# EAGLE design FPC_Breakout (EAGLE 6.2)
AUTHOR: Ryan Julian (ryanjulian@berkeley.edu); DESIGN_NAME: FPC Breakout; REVISION: A; YEAR: 2012
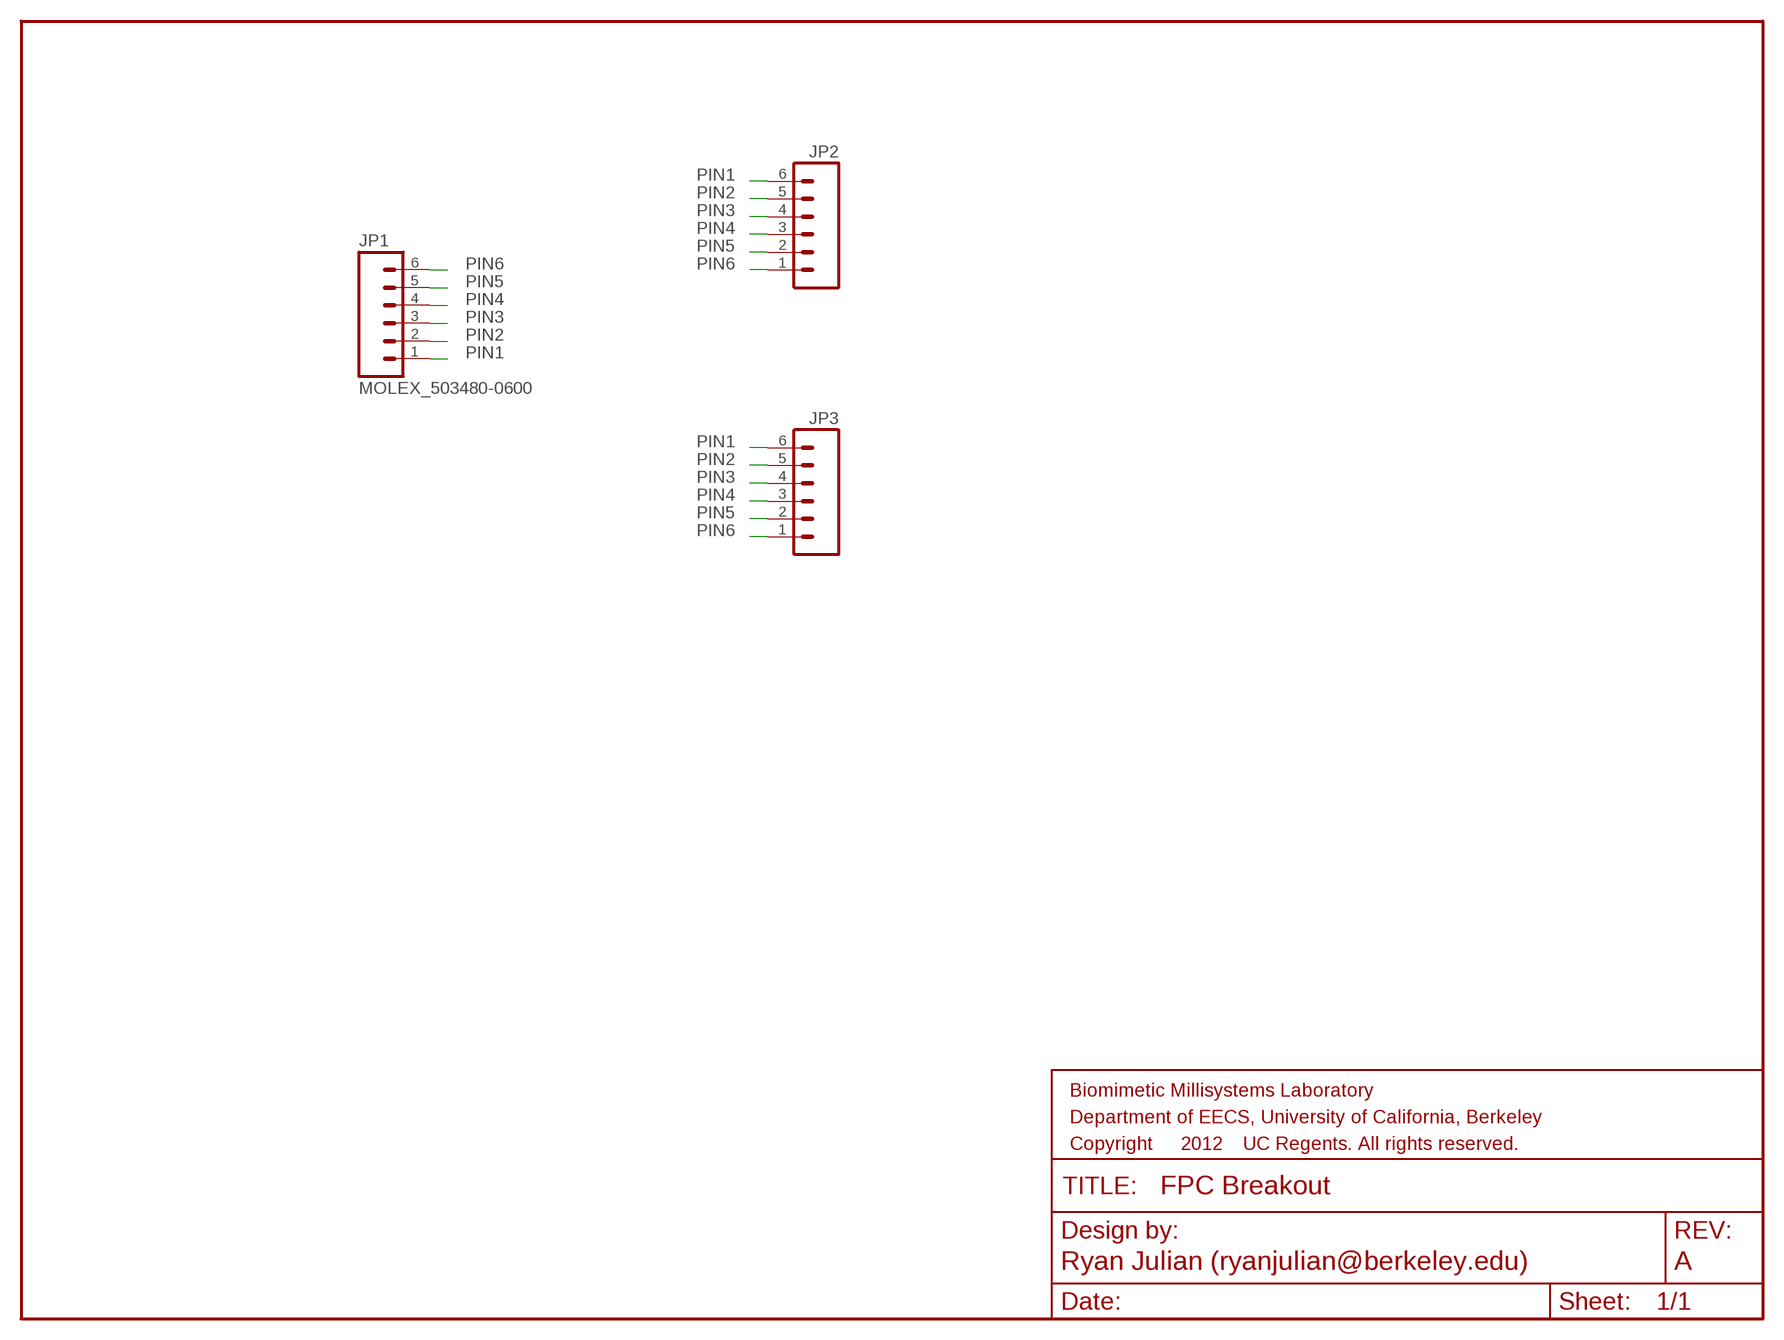
[diagram p0: schematic, sheet 1]
FRAME1 (FRAME-LETTER): SHEET_NAME: FPC Breakout

## Parts
JP1  MOLEX_503480-0600  [MOLEX_503480-0600]
JP2  M06SIP_LOCK  [1X06-SIP_LOCK]
JP3  M061X06-SMD_EDGE_FEMALE  [1X06-SMD_EDGE]

## Nets
PIN1: JP1.1 JP2.6 JP3.6
PIN2: JP1.2 JP2.5 JP3.5
PIN3: JP1.3 JP2.4 JP3.4
PIN4: JP1.4 JP2.3 JP3.3
PIN5: JP1.5 JP2.2 JP3.2
PIN6: JP1.6 JP2.1 JP3.1

## Library data of the parts
JP1 = biomimetic:MOLEX_503480-0600
JP2 JP3 = SparkFun-Connectors:M06: Header 6 Standard 6-pin 0.1" header. Use with straight break away headers (SKU : PRT-00116), right angle break away headers (PRT-00553), swiss pins (PRT-00743), machine pins (PRT-00117), and female headers (PRT-00115). Molex polarized connector foot print use with SKU : PRT-08094 with associated crimp pins and housings. NOTES ON THE VARIANTS LOCK and LOCK_LONGPADS... This footprint was designed to help hold the alignment of a through-hole component (i.e. 6-pin header) while soldering it into place. You may notice that each hole has been shifted either up or down by 0.005 of an inch from it's more standard position (which is a perfectly straight line). This slight alteration caused the pins (the squares in the middle) to touch the edges of the holes. Because they are alternating, it causes a "brace" to hold the component in place. 0.005 has proven to be the perfect amount of "off-center" position when using our standard breakaway headers. Although looks a little odd when you look at the bare footprint, once you have a header in there, the alteration is very hard to notice. Also, if you push a header all the way into place, it is covered up entirely on the bottom side. This idea of altering the position of holes to aid alignment will be further integrated into the Sparkfun Library for other footprints. It can help hold any component with 3 or more connection pins.

## Net classes
1 sup: width 0.254 mm

## Board
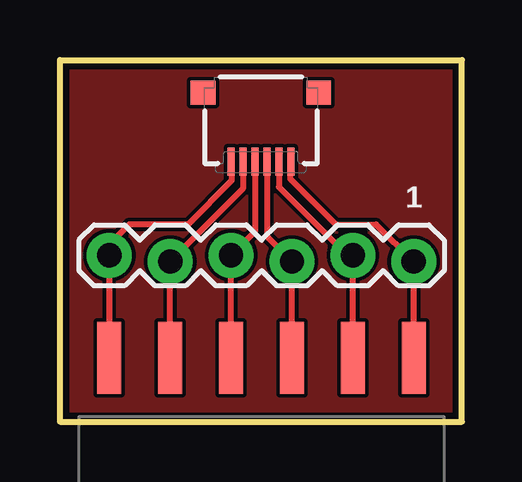
[diagram p1: board, top side]
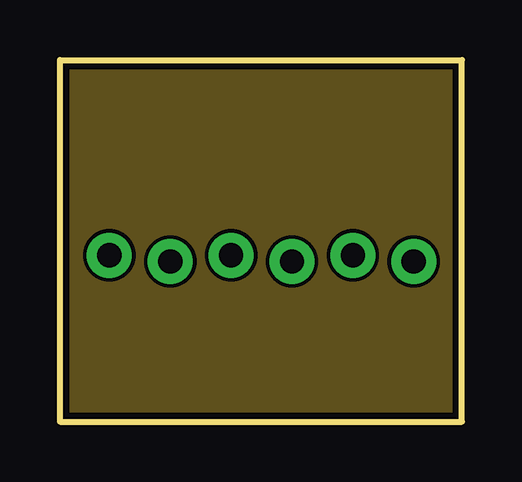
[diagram p2: board, inner layer Ground]
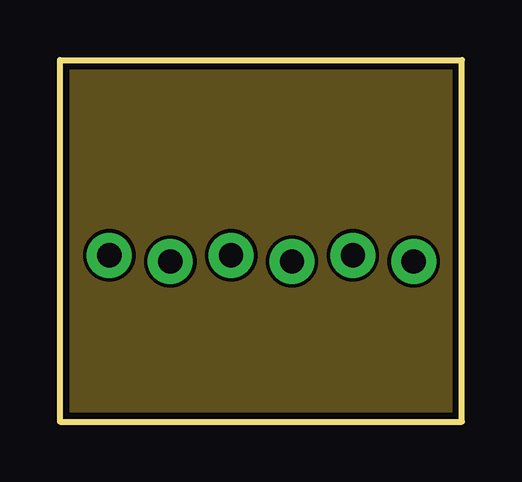
[diagram p3: board, inner layer Power]
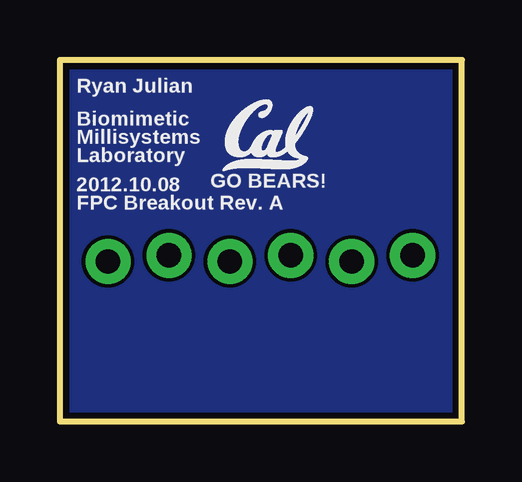
[diagram p4: board, bottom side, seen from below]

Size 16.76 x 15.1 mm. Coordinates in mm from the lower left corner, seen from the top.
Outline: 0,0.01 0,0
Outline: 0,0.01 0,15.1 16.76,15.1 16.76,0.01 0,0.01
Copper layers (1*2+3*16): Top 2mil / dielectric 9mil / Ground 2mil / dielectric 40mil / Power 2mil / dielectric 9mil / Bottom 2mil
Design rules: minimum track width 6mil, minimum drill 15mil, track to track 6mil, track to pad 6mil, pad to pad 6mil, via to via 6mil, smd to smd 6mil, copper to edge 10mil, drill to drill 7mil, minimum pad ring 7mil, minimum via ring 7mil, stop-mask expansion 3mil, vias tented up to drill 0mil, thermal gap 10mil
tKeepout: 4 lines
bKeepout: 4 lines

### Footprints (pad centres in the part's own frame; a part is rotated, then mirrored left to right if it is on the bottom)
MOLEX_503480-0600 = smd 0.3 x 1.15: 1 -1.25,1.725; 2 -0.75,1.725; 3 -0.25,1.725; 4 0.25,1.725; 5 0.75,1.725; 6 1.25,1.725 | smd 1.035 x 1: L -2.408,-1.15; R 2.408,-1.15
1X06-SIP_LOCK = drill 1.016 pad 1.88: 1 0,0; 2 2.54,-0.254; 3 5.08,0; 4 7.62,-0.254; 5 10.16,0; 6 12.7,-0.254
1X06-SMD_EDGE = smd 1 x 3: 1 0,-0.08; 2 2.54,-0.08; 3 5.08,-0.08; 4 7.62,-0.08; 5 10.16,-0.08; 6 12.7,-0.08

### Placement (x,y rotation side)
JP1  8.38,12.58 180 top
JP2  2.06,6.94 0 top
JP3  2.06,2.75 0 top
U$12  [CAL_LOGO]  9.98,10.45 0 bottom

### Tracks (layer width: path | path; a pad name or v marks a point on that pad's centre or on a via)
GND
  pour Top: 0,15.1 16.76,15.1 16.76,0.01 0,0.01
  pour Ground: 0,15.1 16.76,15.1 16.76,0.01 0,0.01
  pour Bottom: 0,15.1 16.76,15.1 16.76,0.01 0,0.01
PIN1
  Top 0.254: JP1.1 9.6,10.83 9.6,10.14 11.51,8.24 13.18,8.24 14.73,6.69 JP2.6 JP3.6
PIN2
  Top 0.254: JP1.2 9.13,9.8 11.99,6.94 JP2.5 JP3.5
PIN3
  Top 0.254: JP1.3 8.63,7.74 JP2.4 JP3.4
PIN4
  Top 0.254: JP1.4 8.13,7.94 JP2.3 JP3.3
PIN5
  Top 0.254: JP1.5 7.63,9.72 JP2.2 JP3.2
PIN6
  Top 0.254: JP1.6 7.16,10.83 7.16,10.07 5.33,8.24 2.9,8.24 2.06,7.4 JP2.1 JP3.1
V_BATT
  pour Power: 0,15.1 16.76,15.1 16.76,0.01 0,0.01

### Text on the board
tPlace: 1
bPlace: Ryan Julian | Biomimetic | Millisystems | Laboratory | GO BEARS! | 2012.10.08 | FPC Breakout Rev. A